# EAGLE schematic vcf (EAGLE 7.2.0)
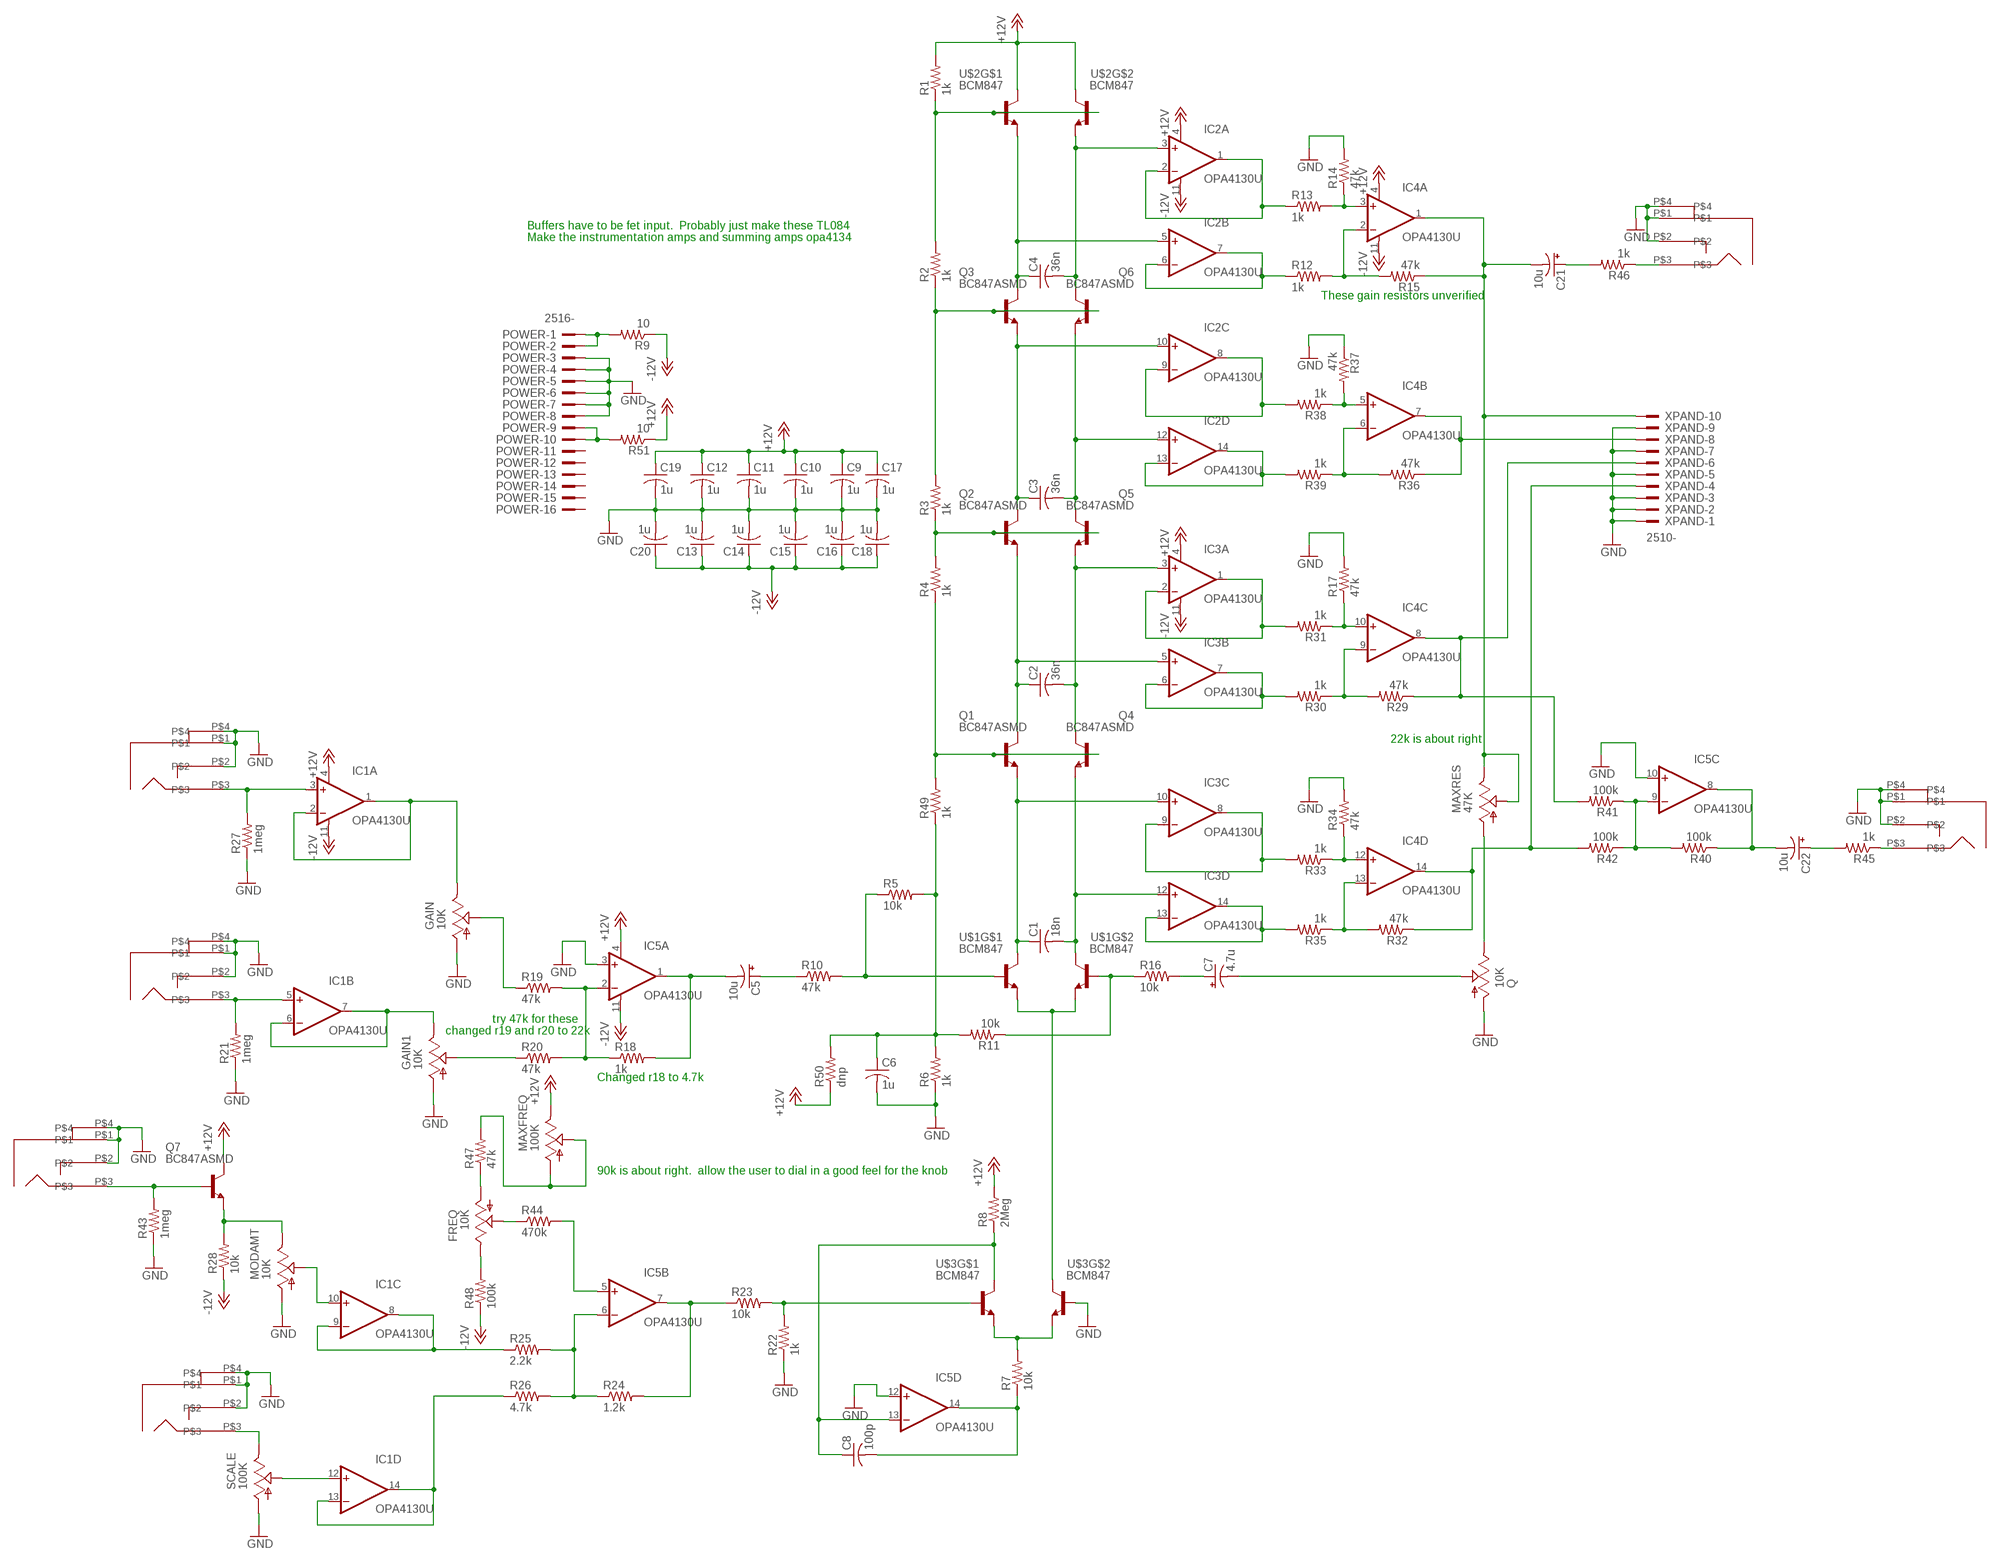
[diagram p0: schematic, sheet 1]

## Parts
AIN  PJ301BM  [PJ301BM]
AIN2  PJ301BM  [PJ301BM]
BP  PJ301BM  [PJ301BM]
C1  18n  C-USC0603  [C0603]
C2  36n  C-USC0603  [C0603]
C3  36n  C-USC0603  [C0603]
C4  36n  C-USC0603  [C0603]
C5  10u  CPOL-USE2.5-6  [E2,5-6]
C6  1u  C-USC0603  [C0603]
C7  4.7u  CPOL-USE2.5-6  [E2,5-6]
C8  100p  C-USC0603  [C0603]
C9  1u  C-USC0603  [C0603]
C10  1u  C-USC0603  [C0603]
C11  1u  C-USC0603  [C0603]
C12  1u  C-USC0603  [C0603]
C13  1u  C-USC0603  [C0603]
C14  1u  C-USC0603  [C0603]
C15  1u  C-USC0603  [C0603]
C16  1u  C-USC0603  [C0603]
C17  1u  C-USC0603  [C0603]
C18  1u  C-USC0603  [C0603]
C19  1u  C-USC0603  [C0603]
C20  1u  C-USC0603  [C0603]
C21  10u  CPOL-USE2.5-6  [E2,5-6]
C22  10u  CPOL-USE2.5-6  [E2,5-6]
FREQ  10K  US-EVUF2J  [EVUFXJ]
GAIN  10K  US-EVUF2J  [EVUFXJ]
GAIN1  10K  US-EVUF2J  [EVUFXJ]
IC1  OPA4130U  [SO14]
IC2  OPA4130U  [SO14]
IC3  OPA4130U  [SO14]
IC4  OPA4130U  [SO14]
IC5  OPA4130U  [SO14]
LP  PJ301BM  [PJ301BM]
MAXFREQ  100K  TRIM_US-S64W  [S64W]
MAXRES  47K  TRIM_US-S64W  [S64W]
MIN  PJ301BM  [PJ301BM]
MODAMT  10K  US-EVUF2J  [EVUFXJ]
POWER  2516-  [PAK100/2500-16]
Q  10K  US-EVUF2J  [EVUFXJ]
Q1  BC847ASMD  [SOT23]
Q2  BC847ASMD  [SOT23]
Q3  BC847ASMD  [SOT23]
Q4  BC847ASMD  [SOT23]
Q5  BC847ASMD  [SOT23]
Q6  BC847ASMD  [SOT23]
Q7  BC847ASMD  [SOT23]
R1  1k  R-US_R0603  [R0603]
R2  1k  R-US_R0603  [R0603]
R3  1k  R-US_R0603  [R0603]
R4  1k  R-US_R0603  [R0603]
R5  10k  R-US_R0603  [R0603]
R6  1k  R-US_R0603  [R0603]
R7  10k  R-US_R0603  [R0603]
R8  2Meg  R-US_R0603  [R0603]
R9  10  R-US_R0603  [R0603]
R10  47k  R-US_R0603  [R0603]
R11  10k  R-US_R0603  [R0603]
R12  1k  R-US_R0603  [R0603]
R13  1k  R-US_R0603  [R0603]
R14  47k  R-US_R0603  [R0603]
R15  47k  R-US_R0603  [R0603]
R16  10k  R-US_R0603  [R0603]
R17  47k  R-US_R0603  [R0603]
R18  1k  R-US_R0603  [R0603]
R19  47k  R-US_R0603  [R0603]
R20  47k  R-US_R0603  [R0603]
R21  1meg  R-US_R0603  [R0603]
R22  1k  R-US_R0603  [R0603]
R23  10k  R-US_R0603  [R0603]
R24  1.2k  R-US_R0603  [R0603]
R25  2.2k  R-US_R0603  [R0603]
R26  4.7k  R-US_R0603  [R0603]
R27  1meg  R-US_R0603  [R0603]
R28  10k  R-US_R0603  [R0603]
R29  47k  R-US_R0603  [R0603]
R30  1k  R-US_R0603  [R0603]
R31  1k  R-US_R0603  [R0603]
R32  47k  R-US_R0603  [R0603]
R33  1k  R-US_R0603  [R0603]
R34  47k  R-US_R0603  [R0603]
R35  1k  R-US_R0603  [R0603]
R36  47k  R-US_R0603  [R0603]
R37  47k  R-US_R0603  [R0603]
R38  1k  R-US_R0603  [R0603]
R39  1k  R-US_R0603  [R0603]
R40  100k  R-US_R0603  [R0603]
R41  100k  R-US_R0603  [R0603]
R42  100k  R-US_R0603  [R0603]
R43  1meg  R-US_R0603  [R0603]
R44  470k  R-US_R0603  [R0603]
R45  1k  R-US_R0603  [R0603]
R46  1k  R-US_R0603  [R0603]
R47  47k  R-US_R0603  [R0603]
R48  100k  R-US_R0603  [R0603]
R49  1k  R-US_R0603  [R0603]
R50  dnp  R-US_R0603  [R0603]
R51  10  R-US_R0603  [R0603]
SCALE  100K  TRIM_US-S64W  [S64W]
U$1  BCM847  [SOT457R_PHILIPS]
U$2  BCM847  [SOT457R_PHILIPS]
U$3  BCM847  [SOT457R_PHILIPS]
VPEROCT  PJ301BM  [PJ301BM]
XPAND  2510-  [PAK100/2500-10]

## Nets
+12V: C9.1 C10.1 C11.1 C12.1 C17.1 C19.1 IC1.4(A:V+) IC2.4(A:V+) IC3.4(A:V+) IC4.4(A:V+) IC5.4(A:V+) MAXFREQ.E Q7.3(C) R1.2 R8.2 R50.1 R51.1 U$2.3(C) U$2.6(C)
-12V: C13.1 C14.1 C15.1 C16.1 C18.1 C20.1 IC1.11(A:V-) IC2.11(A:V-) IC3.11(A:V-) IC4.11(A:V-) IC5.11(A:V-) R9.1 R28.1 R48.1
GND: AIN2.P$1 AIN2.P$2 AIN2.P$4 AIN.P$1 AIN.P$2 AIN.P$4 BP.P$1 BP.P$2 BP.P$4 C6.2 C9.2 C10.2 C11.2 C12.2 C13.2 C14.2 C15.2 C16.2 C17.2 C18.2 C19.2 C20.2 GAIN1.1(A) GAIN.1(A) IC5.3(A:+IN) IC5.10(C:+IN) IC5.12(D:+IN) LP.P$1 LP.P$2 LP.P$4 MIN.P$1 MIN.P$2 MIN.P$4 MODAMT.1(A) POWER.3 POWER.4 POWER.5 POWER.6 POWER.7 POWER.8 Q.1(A) R6.1 R14.2 R17.2 R21.1 R22.1 R27.1 R34.2 R37.1 R43.1 SCALE.A U$3.5(B) VPEROCT.P$1 VPEROCT.P$2 VPEROCT.P$4 XPAND.1 XPAND.2 XPAND.3 XPAND.5 XPAND.7 XPAND.9
N$1: U$1.1(E) U$1.4(E) U$3.3(C)
N$2: C1.1 IC3.10(C:+IN) Q1.2(E) U$1.6(C)
N$3: C2.1 IC3.5(B:+IN) Q1.3(C) Q2.2(E)
N$4: C3.1 IC2.10(C:+IN) Q2.3(C) Q3.2(E)
N$5: C3.2 IC2.12(D:+IN) Q5.3(C) Q6.2(E)
N$6: C2.2 IC3.3(A:+IN) Q4.3(C) Q5.2(E)
N$7: C1.2 IC3.12(D:+IN) Q4.2(E) U$1.3(C)
N$8: C4.2 IC2.3(A:+IN) Q6.3(C) U$2.4(E)
N$9: C4.1 IC2.5(B:+IN) Q3.3(C) U$2.1(E)
N$10: R1.1 R2.2 U$2.2(B) U$2.5(B)
N$11: Q3.1(B) Q6.1(B) R2.1 R3.2
N$12: Q2.1(B) Q5.1(B) R3.1 R4.2
N$13: Q1.1(B) Q4.1(B) R4.1 R49.2
N$14: R5.1 R10.2 U$1.2(B)
N$15: IC5.2(A:-IN) R18.1 R19.2 R20.2
N$16: R7.2 U$3.1(E) U$3.4(E)
N$17: C8.2 IC5.14(D:OUT) R7.1
N$18: MIN.P$3 Q7.1(B) R43.2
N$19: C8.1 IC5.13(D:-IN) R8.1 U$3.6(C)
N$20: C5.- IC5.1(A:OUT) R18.2
N$21: C5.+ R10.1
N$22: R11.1 R16.1 U$1.5(B)
N$23: IC2.1(A:OUT) IC2.2(A:-IN) R13.1
N$24: IC5.5(B:+IN) R44.2
N$25: IC4.2(A:-IN) R12.2 R15.2
N$26: IC4.3(A:+IN) R13.2 R14.1
N$27: C21.- IC4.1(A:OUT) MAXRES.E MAXRES.S R15.1 XPAND.10
N$28: IC2.8(C:OUT) IC2.9(C:-IN) R38.2
N$29: IC1.8(C:OUT) IC1.9(C:-IN) R25.1
N$30: GAIN1.3(E) IC1.6(B:-IN) IC1.7(B:OUT)
N$31: C7.+ R16.2
N$32: C7.- Q.2(S)
N$33: MODAMT.3(E) Q7.2(E) R28.2
N$34: R22.2 R23.2 U$3.2(B)
N$35: IC2.6(B:-IN) IC2.7(B:OUT) R12.1
N$36: IC5.6(B:-IN) R24.1 R25.2 R26.2
N$37: IC3.1(A:OUT) IC3.2(A:-IN) R31.2
N$38: IC1.13(D:-IN) IC1.14(D:OUT) R26.1
N$39: IC3.8(C:OUT) IC3.9(C:-IN) R33.2
N$40: SCALE.E VPEROCT.P$3
N$41: IC1.12(D:+IN) SCALE.S
N$42: IC2.13(D:-IN) IC2.14(D:OUT) R39.2
N$43: GAIN.2(S) R19.1
N$44: IC3.6(B:-IN) IC3.7(B:OUT) R30.2
N$45: IC4.10(C:+IN) R17.1 R31.1
N$46: IC4.9(C:-IN) R29.2 R30.1
N$47: IC4.8(C:OUT) R29.1 R41.2 XPAND.6
N$48: IC3.13(D:-IN) IC3.14(D:OUT) R35.2
N$49: BP.P$3 R45.1
N$50: IC1.10(C:+IN) MODAMT.2(S)
N$51: IC4.13(D:-IN) R32.2 R35.1
N$52: IC4.14(D:OUT) R32.1 R42.2 XPAND.4
N$53: IC5.7(B:OUT) R23.1 R24.2
N$54: IC4.12(D:+IN) R33.1 R34.1
N$55: IC4.5(B:+IN) R37.2 R38.1
N$56: IC4.6(B:-IN) R36.2 R39.1
N$57: GAIN1.2(S) R20.1
N$58: IC4.7(B:OUT) R36.1 XPAND.8
N$59: IC5.9(C:-IN) R40.2 R41.1 R42.1
N$60: FREQ.1(A) R47.1
N$61: C22.- IC5.8(C:OUT) R40.1
N$62: AIN.P$3 IC1.3(A:+IN) R27.2
N$63: C21.+ R46.2
N$64: LP.P$3 R46.1
N$65: FREQ.2(S) R44.1
N$66: FREQ.3(E) R48.2
N$67: GAIN.3(E) IC1.1(A:OUT) IC1.2(A:-IN)
N$68: C6.1 R5.2 R6.2 R11.2 R49.1 R50.2
N$69: AIN2.P$3 IC1.5(B:+IN) R21.2
N$70: C22.+ R45.2
N$71: POWER.9 POWER.10 R51.2
N$72: POWER.1 POWER.2 R9.2
N$73: MAXFREQ.A MAXFREQ.S R47.2
N$74: MAXRES.A Q.3(E)
Unconnected: POWER.11 POWER.12 POWER.13 POWER.14 POWER.15 POWER.16

## Notes on the sheet
- Buffers have to be fet input.  Probably just make these TL084
- Make the instrumentation amps and summing amps opa4134
- These gain resistors unverified
- 22k is about right
- try 47k for these
- changed r19 and r20 to 22k
- Changed r18 to 4.7k
- 90k is about right.  allow the user to dial in a good feel for the knob

## Library data of the parts
AIN AIN2 BP LP MIN VPEROCT = dan:PJ301BM
C1-C4 C6 C8-C20 = dan:C-US: CAPACITOR, American symbol
C5 C7 C21 C22 = dan:CPOL-US: POLARIZED CAPACITOR, American symbol
FREQ GAIN GAIN1 MODAMT Q = dan:US-EVU: 9 mm Square Rotary Potentiometers Source: Panasonic
IC1-IC5 = dan:OPA4130: Low Power, Precision FET-Input Operational Amplifiers; MF: TEXAS INSTRUMENTS; MPN: OPA4130UA; OC_FARNELL: 1648707; OC_NEWARK: 80K8080
MAXFREQ MAXRES SCALE = dan:TRIM_US-: POTENTIOMETER
POWER = dan:2516-: 3M (TM) Pak 100 4-Wall Header Source: 3M; OC_FARNELL: unknown; OC_NEWARK: unknown
Q1-Q7 = dan:BC847*: NPN Transistor
R1-R51 = dan:R-US_: RESISTOR, American symbol
U$1-U$3 = dan:BCM847
XPAND = dan:2510-: 3M (TM) Pak 100 4-Wall Header Source: 3M; MF: 3M; MPN: 2510-6002UB; OC_FARNELL: 9838244; OC_NEWARK: 46F4725